# Altium schematic sheet CAN.SchDoc
size A4
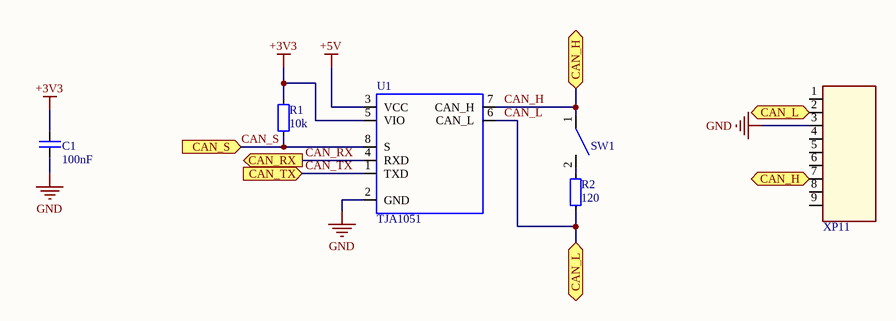
[diagram p0: CAN.SchDoc]

## Parts
C1  100nF  [SMD_0805]
R1  10k  [SMD_0805]
R2  120  [SMD_0805]
SW1  SW_DIP/2.54  [DIP-SW/2.54/1]  (value not drawn)
U1  TJA1051  [SO8-150mil]
XP11  DB9M_CABLE  [DSUB-9_M_Edge]  (value not drawn)

## Ports
CAN_H, CAN_L, CAN_RX (out), CAN_S (in), CAN_TX (in)

## Nets
+3V3: C1.1 R1.2 U1.5(VIO)
+5V: U1.3(VCC)
GND: C1.2 U1.2(GND) XP11.3
CAN_H: SW1.1 U1.7(CAN_H) XP11.7 ; port CAN_H
CAN_L: R2.1 U1.6(CAN_L) XP11.2 ; port CAN_L
CAN_RX: U1.4(RXD) ; port CAN_RX
CAN_S: R1.1 U1.8(S) ; port CAN_S
CAN_TX: U1.1(TXD) ; port CAN_TX
NetR2_2: R2.2 SW1.2

Not connected (* = marked no-connect by the designer): SW1 3 4; XP11 1 4 5 6 8 9

## Library data of the parts
C1 = C_NONE_POLAR: None polar capacitor; Value: 100nF
R1 R2 = RES: Resistor
  R1: Value: 10k
  R2: Value: 120
SW1 = SW: Switch
XP11 = DB9F_EDGE